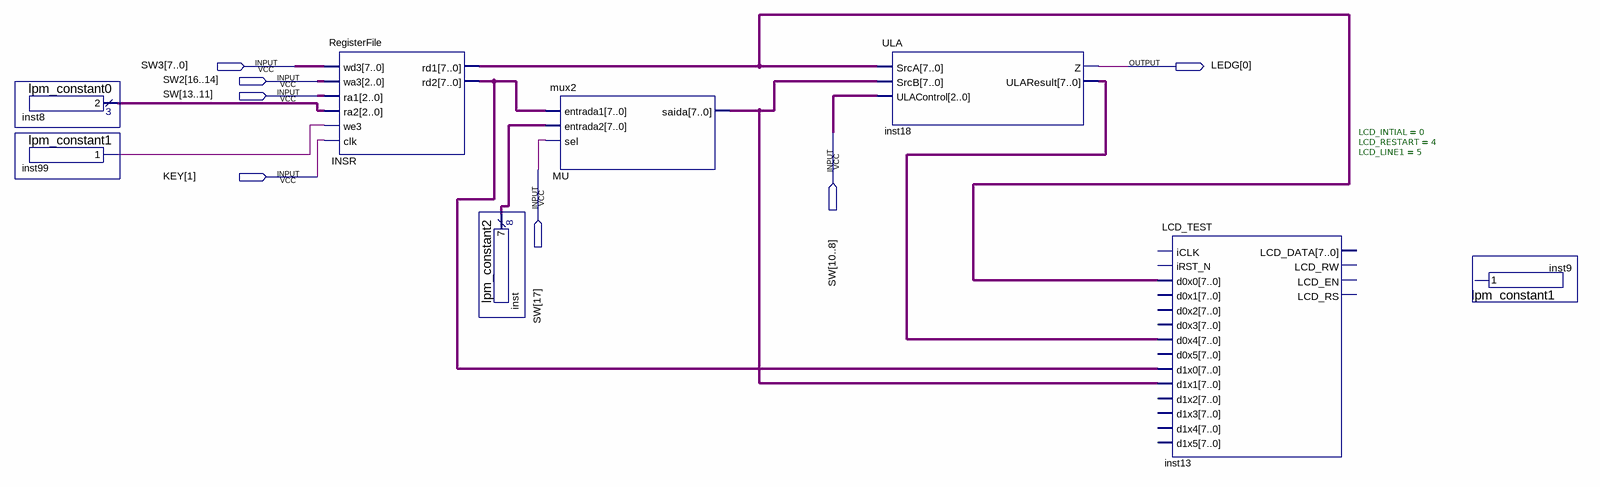
[diagram p0: schematic sheet]
// Quartus schematic Block1.bdf as structural Verilog: 8 symbols, 7 pins
module Block1 (
  input  [7:0] SW3,
  input  [16:14] SW2,
  input  [17:8] SW,
  input  [1:1] KEY,
  output [0:0] LEDG
);

  wire inst99_result;
  wire [2:0] inst8_result;
  wire [7:0] INSR_rd1, INSR_rd2, inst18_ularesult, inst_result, MU_saida;

  lpm_constant0 inst8 (.result(inst8_result));
  lpm_constant1 inst99 (.result(inst99_result));
  RegisterFile INSR (
    .wd3(SW3), .wa3(SW2), .ra1(SW[13:11]), .ra2(inst8_result), .we3(inst99_result), .clk(KEY[1]),
    .rd1(INSR_rd1), .rd2(INSR_rd2));
  lpm_constant2 inst (.result(inst_result));
  mux2 MU (.entrada1(INSR_rd2), .entrada2(inst_result), .sel(SW[17]), .saida(MU_saida));
  ULA inst18 (.SrcA(INSR_rd1), .SrcB(MU_saida), .ULAControl(SW[10:8]), .Z(LEDG[0]), .ULAResult(inst18_ularesult));
  LCD_TEST #(.LCD_INTIAL(0), .LCD_RESTART(4), .LCD_LINE1(5)) inst13 (
    .d0x0(INSR_rd1), .d0x4(inst18_ularesult), .d1x0(INSR_rd2), .d1x1(MU_saida));  // open: iCLK, iRST_N, d0x1, d0x2, d0x3, d0x5, d1x2, d1x3, d1x4, d1x5, LCD_DATA, LCD_RW, LCD_EN, LCD_RS
  lpm_constant1 inst9 ();  // open: result
endmodule
